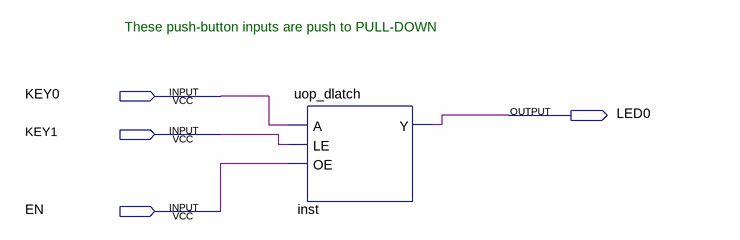
[diagram p0: schematic sheet]
// Quartus schematic comb_logic.bdf as structural Verilog: 1 symbols, 4 pins
module comb_logic (
  input  KEY0,
  input  KEY1,
  input  EN,
  output LED0
);

  uop_dlatch inst (.A(KEY0), .LE(KEY1), .OE(EN), .Y(LED0));

  // Notes on the sheet:
  //   These push-button inputs are push to PULL-DOWN
endmodule
